# EasyEDA schematic SCH_Smart-Traffic-Light_2025-03-28 (1).json
TITLE: Smart Traffic Light System; REV: 1.0; Date: 2025-03-27; Sheet: 1/1; Drawn By: Group 18; Company: Electrical 3
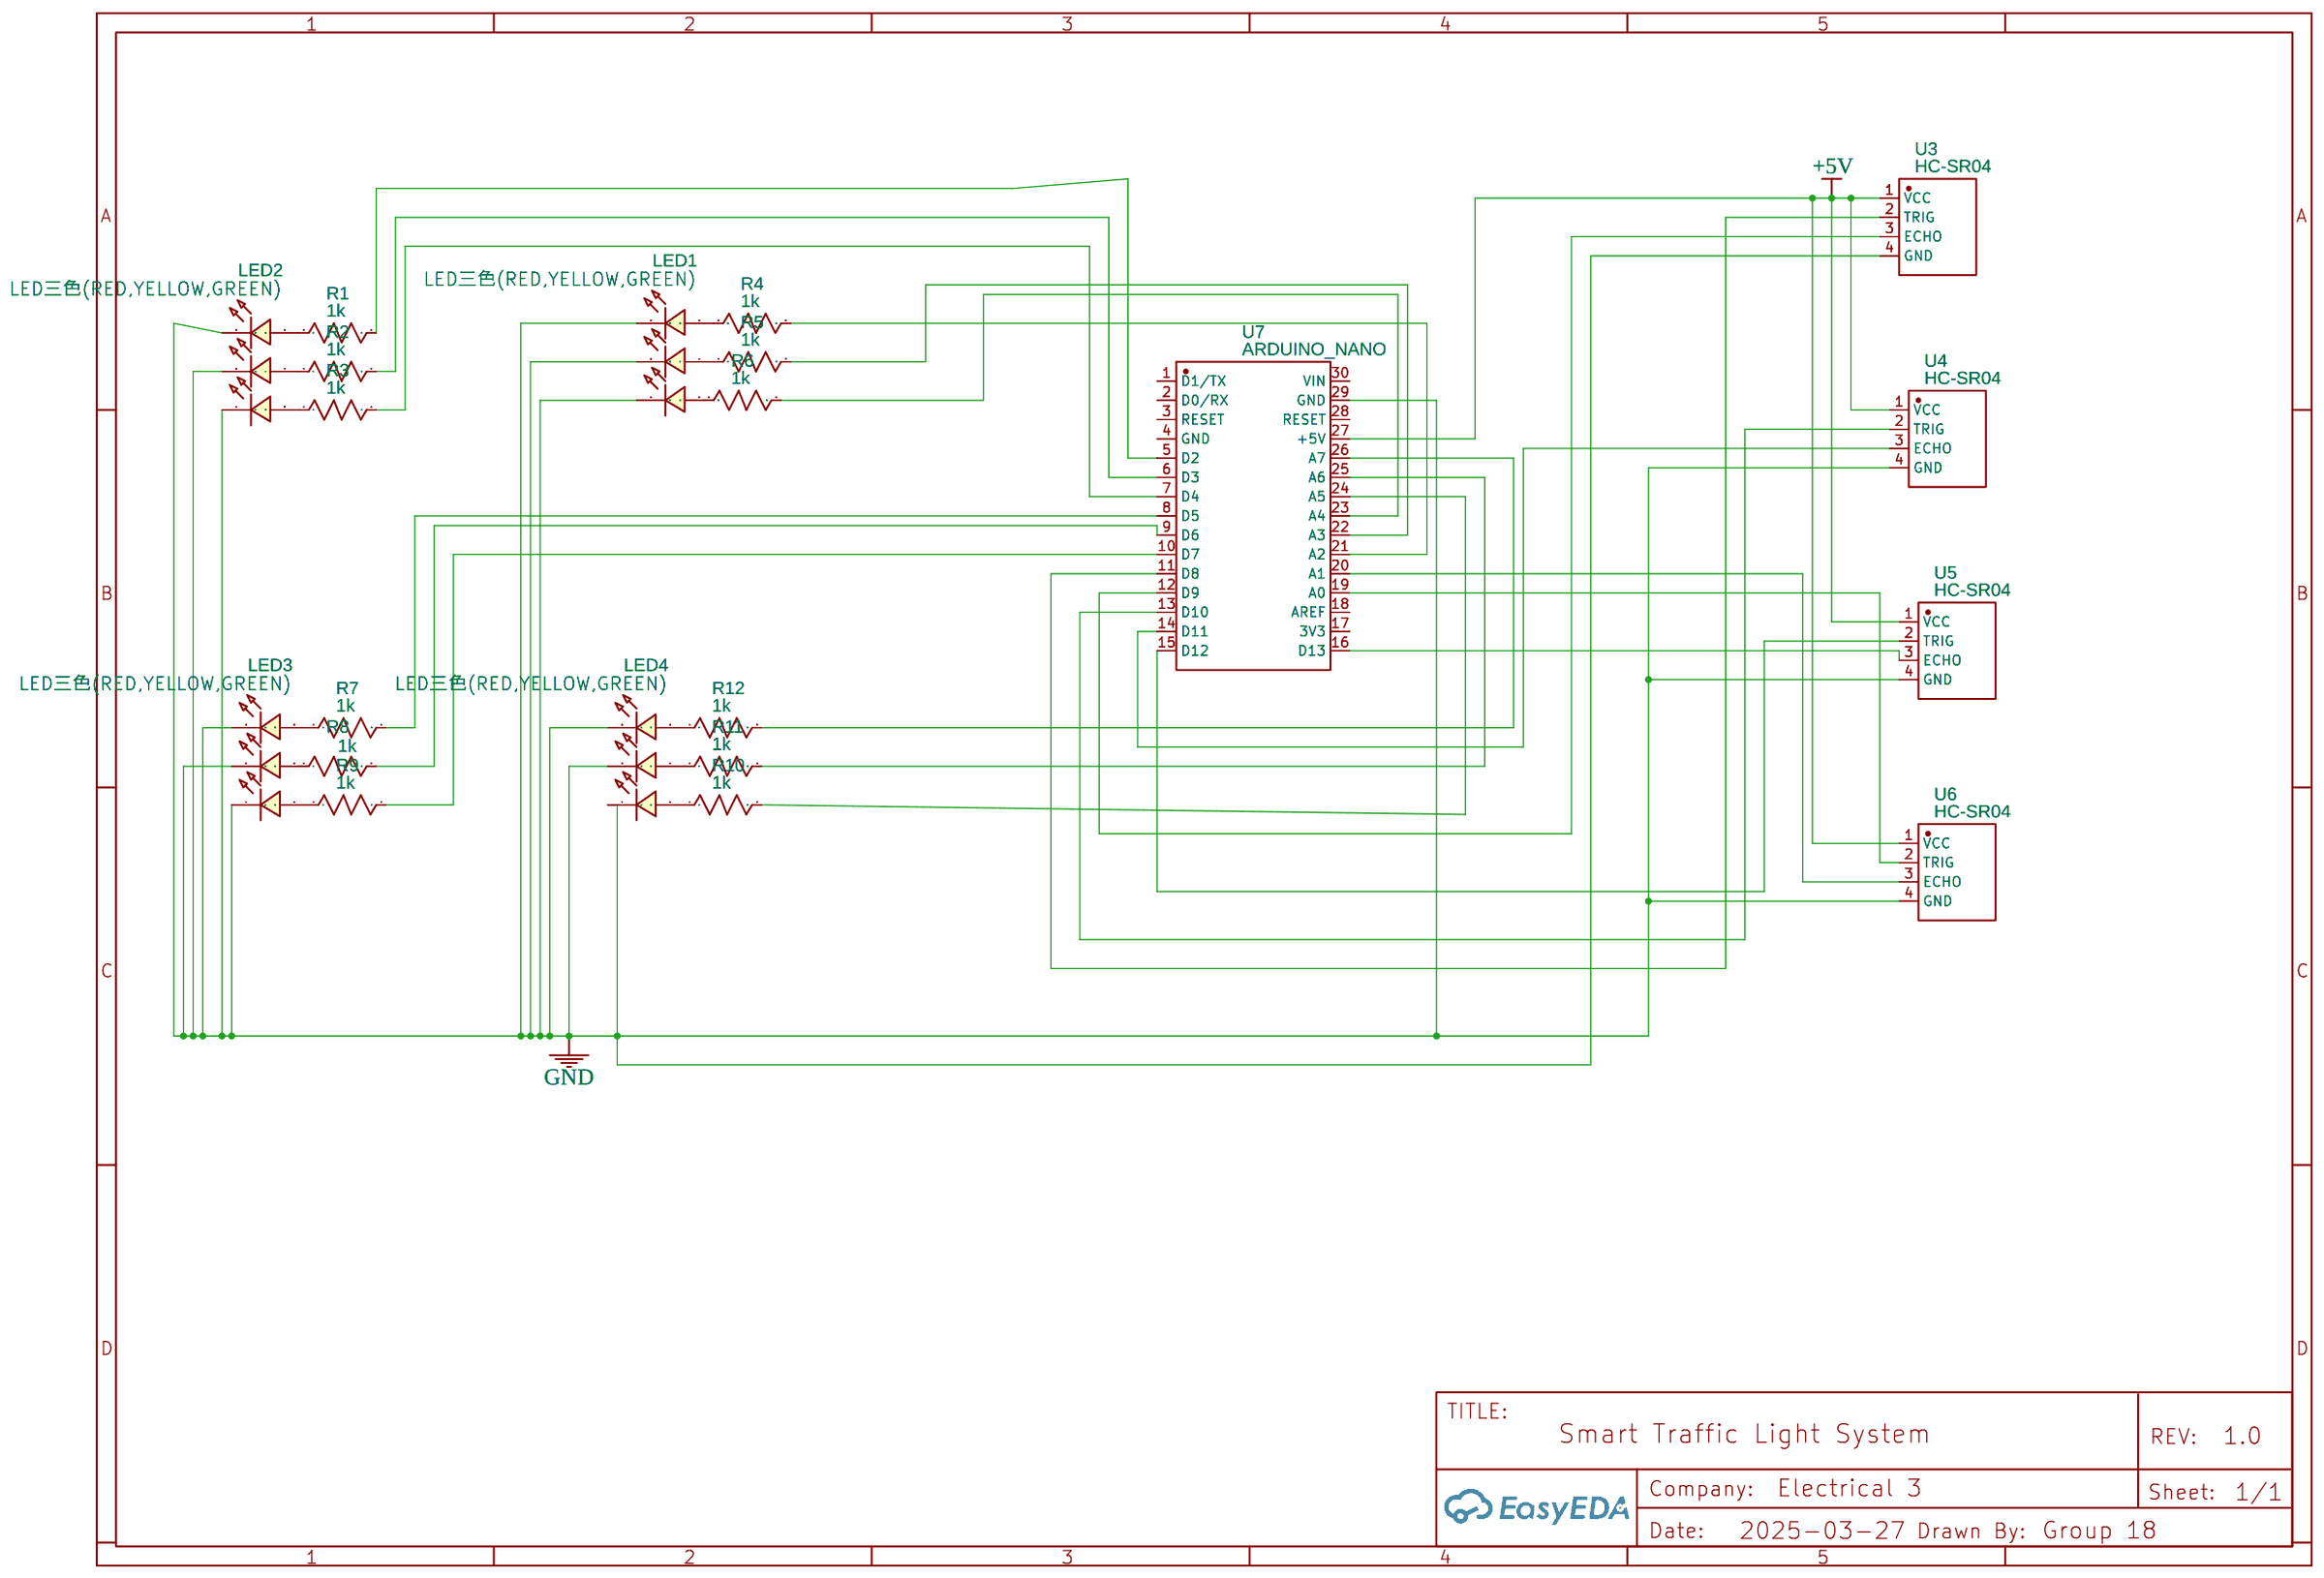
[diagram p0: schematic sheet]

## Parts
LED1  LED三色(RED,YELLOW,GREEN)  [LED-TH_6P_LED4GREEN]
LED2  LED三色(RED,YELLOW,GREEN)  [LED-TH_6P_LED4GREEN]
LED3  LED三色(RED,YELLOW,GREEN)  [LED-TH_6P_LED4GREEN]
LED4  LED三色(RED,YELLOW,GREEN)  [LED-TH_6P_LED4GREEN]
R1  1k  [R0603]
R2  1k  [R0603]
R3  1k  [R0603]
R4  1k  [R0603]
R5  1k  [R0603]
R6  1k  [R0603]
R7  1k  [R0603]
R8  1k  [R0603]
R9  1k  [R0603]
R10  1k  [R0603]
R11  1k  [R0603]
R12  1k  [R0603]
U3  HC-SR04  [TH_HC-SR04V]
U4  HC-SR04  [TH_HC-SR04V]
U5  HC-SR04  [TH_HC-SR04V]
U6  HC-SR04  [TH_HC-SR04V]
U7  ARDUINO_NANO  [COMM-TH_ARDUINO_NANO]

## Library data of the parts
LED1-LED4 = LED三色(RED,YELLOW,GREEN): Contributor: lcsc; Supplier: LCSC; Supplier Part: C9900027004; Manufacturer: null; Manufacturer Part: LED三色(Red,Yellow,Green)
R1-R12 = R_0603_US: Contributor: LCEDA_Lib
U3-U6 = HC-SR04: Supplier: LCSC; Supplier Part: C19857336; Manufacturer: Universal Microelectronics; Contributor: lcsc; JLCPCB Part Class: Extended Part
U7 = ARDUINO_NANO: Contributor: lcsc; Supplier: LCSC; Supplier Part: C9900017879; Manufacturer: null; JLCPCB Part Class: Extended Part

## Nets
+5V: U3.1(VCC) U4.1(VCC) U5.1(VCC) U6.1(VCC) U7.27(+5V)
GND: LED1.1 LED1.3 LED1.5 LED2.1 LED2.3 LED2.5 LED3.1 LED3.3 LED3.5 LED4.1 LED4.3 LED4.5 U3.4(GND) U4.4(GND) U5.4(GND) U6.4(GND) U7.29(GND)
Net-(LED1-4): LED1.4 R5.1
Net-(LED1-6): LED1.6 R4.1
Net-(LED2-2): LED2.2 R3.1
Net-(LED2-4): LED2.4 R2.1
Net-(LED2-6): LED2.6 R1.1
Net-(LED3-2): LED3.2 R9.1
Net-(LED3-6): LED3.6 R7.1
Net-(LED4-2): LED4.2 R10.1
Net-(LED4-4): LED4.4 R11.1
Net-(LED4-6): LED4.6 R12.1
Net-(R1-2): R1.2 U7.5(D2)
Net-(R2-2): R2.2 U7.6(D3)
Net-(R3-2): R3.2 U7.7(D4)
Net-(R4-2): R4.2 U7.21(A2)
Net-(R5-2): R5.2 U7.22(A3)
Net-(R6-2): R6.2 U7.23(A4)
Net-(R7-2): R7.2 U7.8(D5)
Net-(R8-2): R8.2 U7.9(D6)
Net-(R9-2): R9.2 U7.10(D7)
Net-(R10-2): R10.2 U7.24(A5)
Net-(R11-2): R11.2 U7.25(A6)
Net-(R12-2): R12.2 U7.26(A7)
Net-(U3-2): U3.2(TRIG) U7.11(D8)
Net-(U3-3): U3.3(ECHO) U7.12(D9)
Net-(U4-2): U4.2(TRIG) U7.13(D10)
Net-(U4-3): U4.3(ECHO) U7.14(D11)
Net-(U5-2): U5.2(TRIG) U7.15(D12)
Net-(U5-3): U5.3(ECHO) U7.16(D13)
Net-(U6-2): U6.2(TRIG) U7.19(A0)
Net-(U6-3): U6.3(ECHO) U7.20(A1)

Not connected (* = marked no-connect by the designer): LED1 2; LED3 4; R6 1; R8 1; U7 1(D1/TX) 2(D0/RX) 3(RESET) 4(GND) 17(3V3) 18(AREF) 28(RESET) 30(VIN)
